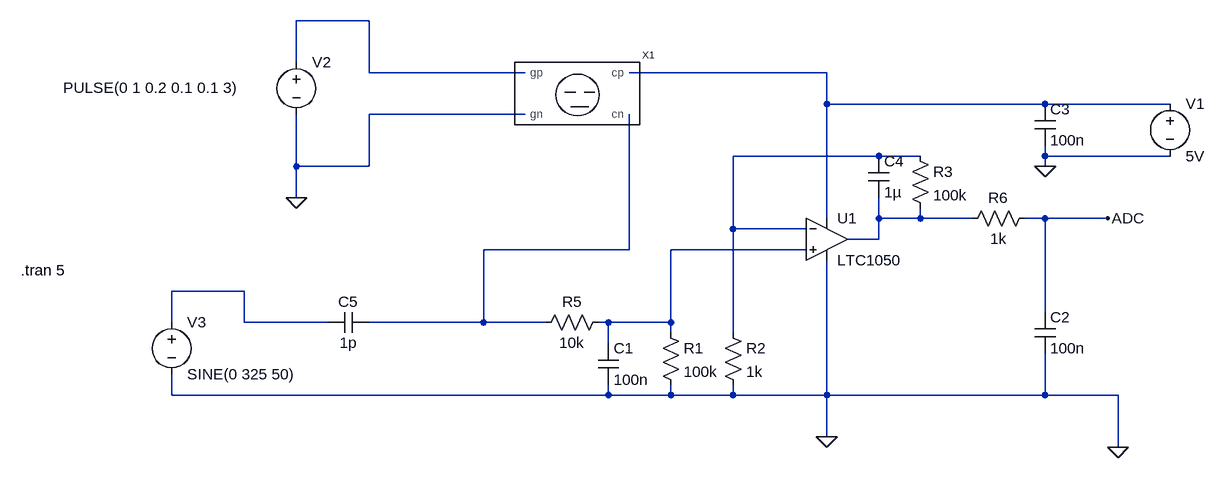
[diagram p0: schematic ampli transimpedance capteur publi.asc]
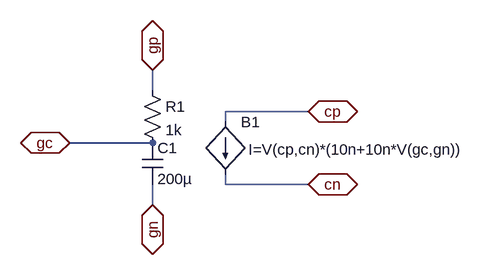
[diagram p1: sub-circuit capteur_graphite.asc]
ampli transimpedance capteur publi.asc, the LTspice schematic file:
Version 4
SHEET 1 1224 680
WIRE -64 -416 -176 -416
WIRE -176 -352 -176 -416
WIRE -64 -336 -64 -416
WIRE 176 -336 -64 -336
WIRE 640 -336 336 -336
WIRE 640 -288 640 -336
WIRE 976 -288 640 -288
WIRE 1168 -288 976 -288
WIRE 176 -272 -64 -272
WIRE 720 -208 496 -208
WIRE 784 -208 720 -208
WIRE 976 -208 976 -224
WIRE 1168 -208 976 -208
WIRE -176 -192 -176 -272
WIRE -64 -192 -64 -272
WIRE -64 -192 -176 -192
WIRE 976 -192 976 -208
WIRE -176 -144 -176 -192
WIRE 640 -112 640 -288
WIRE 720 -112 720 -144
WIRE 784 -112 784 -128
WIRE 784 -112 720 -112
WIRE 864 -112 784 -112
WIRE 976 -112 944 -112
WIRE 1072 -112 976 -112
WIRE 496 -96 496 -208
WIRE 608 -96 496 -96
WIRE 720 -80 720 -112
WIRE 720 -80 672 -80
WIRE 336 -64 336 -272
WIRE 336 -64 112 -64
WIRE 608 -64 400 -64
WIRE -256 0 -368 0
WIRE 976 32 976 -112
WIRE -368 48 -368 0
WIRE -256 48 -256 0
WIRE -128 48 -256 48
WIRE 112 48 112 -64
WIRE 112 48 -64 48
WIRE 208 48 112 48
WIRE 304 48 288 48
WIRE 400 48 400 -64
WIRE 400 48 304 48
WIRE 400 64 400 48
WIRE 496 64 496 -96
WIRE 304 80 304 48
WIRE -368 160 -368 128
WIRE 304 160 304 144
WIRE 304 160 -368 160
WIRE 400 160 400 144
WIRE 400 160 304 160
WIRE 496 160 496 144
WIRE 496 160 400 160
WIRE 640 160 640 -48
WIRE 640 160 496 160
WIRE 976 160 976 96
WIRE 976 160 640 160
WIRE 1088 160 976 160
WIRE 640 224 640 160
WIRE 1088 240 1088 160
FLAG 640 224 0
FLAG 1088 240 0
FLAG 976 -192 0
FLAG 1072 -112 ADC
FLAG -176 -144 0
SYMBOL res 304 32 R90
WINDOW 0 0 56 VBottom 2
WINDOW 3 32 56 VTop 2
SYMATTR InstName R5
SYMATTR Value 10k
SYMBOL cap 288 80 R0
SYMATTR InstName C1
SYMATTR Value 100n
SYMBOL res 384 48 R0
SYMATTR InstName R1
SYMATTR Value 100k
SYMBOL res 480 48 R0
SYMATTR InstName R2
SYMATTR Value 1k
SYMBOL res 848 -96 R270
WINDOW 0 32 56 VTop 2
WINDOW 3 0 56 VBottom 2
SYMATTR InstName R6
SYMATTR Value 1k
SYMBOL res 768 -224 R0
SYMATTR InstName R3
SYMATTR Value 100k
SYMBOL cap 704 -208 R0
SYMATTR InstName C4
SYMATTR Value 1µ
SYMBOL cap 960 32 R0
SYMATTR InstName C2
SYMATTR Value 100n
SYMBOL cap 960 -288 R0
SYMATTR InstName C3
SYMATTR Value 100n
SYMBOL voltage 1168 -304 R0
WINDOW 123 0 0 Left 0
WINDOW 39 0 0 Left 0
SYMATTR InstName V1
SYMATTR Value 5V
SYMBOL OpAmps\\LTC1050 640 -144 R0
SYMATTR InstName U1
SYMBOL capteur_graphite 256 -304 R0
SYMATTR InstName X1
SYMBOL voltage -176 -368 R0
WINDOW 3 -359 55 Left 2
WINDOW 123 0 0 Left 0
WINDOW 39 0 0 Left 0
SYMATTR Value PULSE(0 1 0.2 0.1 0.1 3)
SYMATTR InstName V2
SYMBOL cap -64 32 R90
WINDOW 0 0 32 VBottom 2
WINDOW 3 32 32 VTop 2
SYMATTR InstName C5
SYMATTR Value 1p
SYMBOL voltage -368 32 R0
WINDOW 123 0 0 Left 0
WINDOW 39 0 0 Left 0
SYMATTR InstName V3
SYMATTR Value SINE(0 325 50)
TEXT -600 -32 Left 2 !.tran 5

capteur_graphite.asc, the sub-circuit schematic file:
Version 4
SHEET 1 880 680
WIRE 80 48 80 16
WIRE 320 80 192 80
WIRE 192 96 192 80
WIRE 80 128 -48 128
WIRE 192 192 192 176
WIRE 320 192 192 192
WIRE 80 224 80 192
FLAG 320 80 cp
IOPIN 320 80 BiDir
FLAG 320 192 cn
IOPIN 320 192 BiDir
FLAG 80 16 gp
IOPIN 80 16 BiDir
FLAG 80 224 gn
IOPIN 80 224 BiDir
FLAG -48 128 gc
IOPIN -48 128 BiDir
SYMBOL bi 192 96 R0
WINDOW 3 36 42 Left 2
SYMATTR InstName B1
SYMATTR Value I=V(cp,cn)*(10n+10n*V(gc,gn))
SYMBOL res 64 32 R0
SYMATTR InstName R1
SYMATTR Value 1k
SYMBOL cap 64 128 R0
SYMATTR InstName C1
SYMATTR Value 200µ

The netlist it stands for:
* ampli transimpedance capteur publi.asc
R5 N006 N005 10k
C1 N006 0 100n
R1 N006 0 100k
R2 N003 0 1k
R6 N004 ADC 1k
R3 N003 N004 100k
C4 N003 N004 1µ
C2 ADC 0 100n
C3 N002 0 100n
V1 N002 0 5V
XU1 N006 N003 N002 0 N004 LTC1050  ; pins In+ In- V+ V- OUT
XX1 N002 N005 N001 0 capteur_graphite
V2 N001 0 PULSE(0 1 0.2 0.1 0.1 3)
C5 N005 N007 1p
V3 N007 0 SINE(0 325 50)

* block symbol definitions
.subckt capteur_graphite cp cn gp gn
B1 cp cn I=V(cp,cn)*(10n+10n*V(gc,gn))
R1 gp gc 1k
C1 gc gn 200µ
.ends capteur_graphite

.tran 5
.lib LTC.lib
.backanno
.end